# EAGLE design untitled (EAGLE 9.6.2)
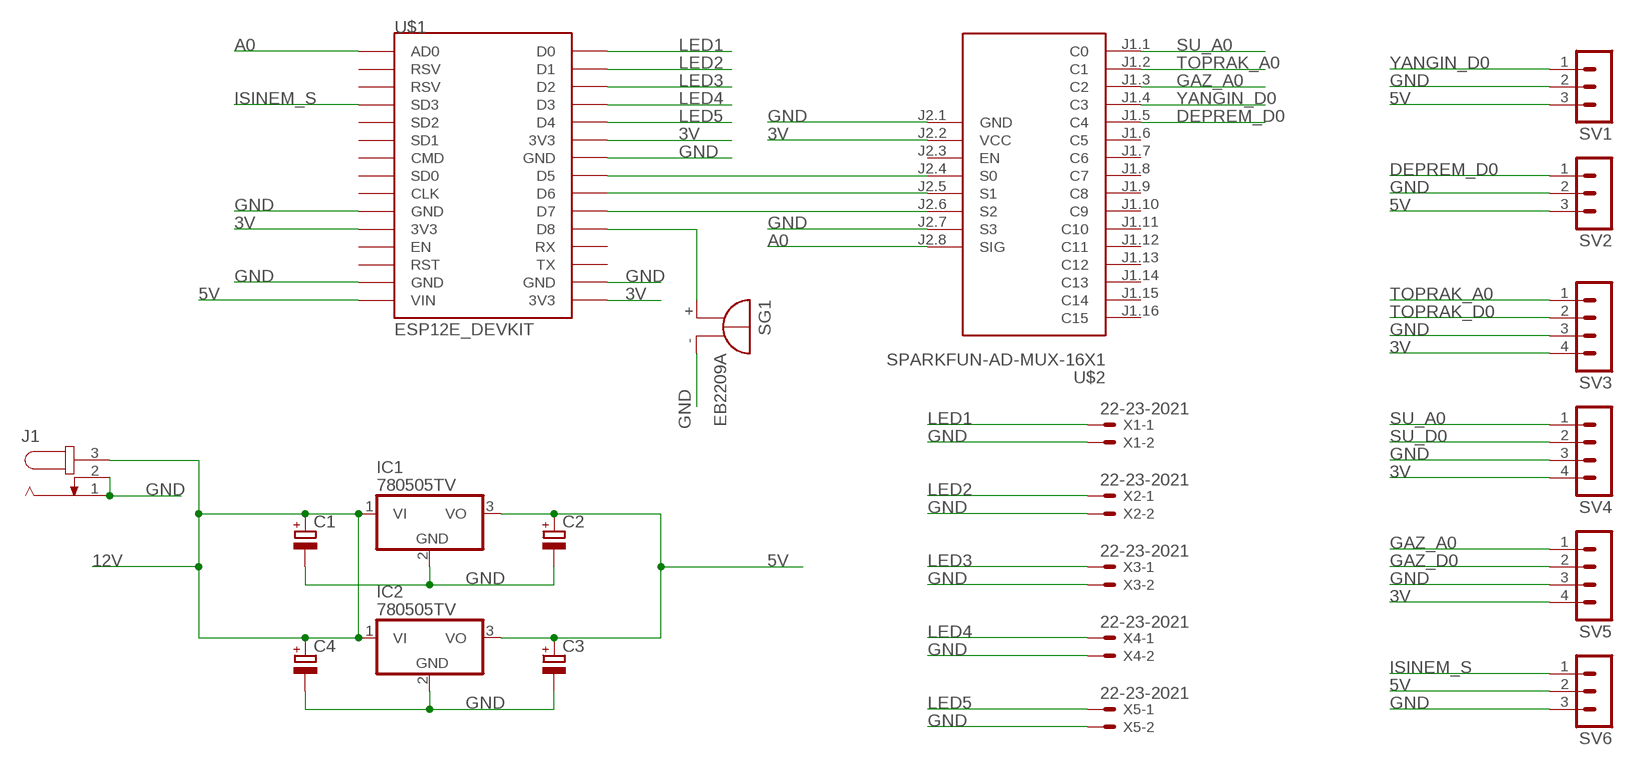
[diagram p0: schematic, sheet 1]

## Parts
C1  CPOL-EUE5-5  [E5-5]
C2  CPOL-EUE5-5  [E5-5]
C3  CPOL-EUE5-5  [E5-5]
C4  CPOL-EUE5-5  [E5-5]
IC1  780505TV  [TO220V]
IC2  780505TV  [TO220V]
J1  JACK-PLUG1  [SPC4078]
SG1  EB2209A  [EB2209A]
SV1  MA03-1  [MA03-1]
SV2  MA03-1  [MA03-1]
SV3  MA04-1  [MA04-1]
SV4  MA04-1  [MA04-1]
SV5  MA04-1  [MA04-1]
SV6  MA03-1  [MA03-1]
U$1  ESP12E_DEVKIT  [ESP12E_DEVKIT]
U$2  SPARKFUN-AD-MUX-16X1  [SPARKFUN-AD-MUX-16X1]
X1  22-23-2021  [22-23-2021]
X2  22-23-2021  [22-23-2021]
X3  22-23-2021  [22-23-2021]
X4  22-23-2021  [22-23-2021]
X5  22-23-2021  [22-23-2021]

## Nets
3V: SV3.4 SV4.4 SV5.4 U$1.3V3@0(3V3) U$1.3V3@1(3V3) U$1.3V3@2(3V3) U$2.J2.2(VCC)
5V: C2.+ C3.+ IC1.3(VO) IC2.3(VO) SV1.3 SV2.3 SV6.2 U$1.VIN
12V: C1.+ C4.+ IC1.1(VI) IC2.1(VI) J1.3
A0: U$1.AD0 U$2.J2.8(SIG)
DEPREM_D0: SV2.1 U$2.J1.5(C4)
GAZ_A0: SV5.1 U$2.J1.3(C2)
GAZ_D0: SV5.2
GND: C1.- C2.- C3.- C4.- IC1.2(GND) IC2.2(GND) J1.1 J1.2 SG1.- SV1.2 SV2.2 SV3.3 SV4.3 SV5.3 SV6.3 U$1.GND@0(GND) U$1.GND@1(GND) U$1.GND@2(GND) U$1.GND@3(GND) U$2.J2.1(GND) U$2.J2.7(S3) X1.2 X2.2 X3.2 X4.2 X5.2
ISINEM_S: SV6.1 U$1.SD3
LED1: U$1.D0 X1.1
LED2: U$1.D1 X2.1
LED3: U$1.D2 X3.1
LED4: U$1.D3 X4.1
LED5: U$1.D4 X5.1
N$1: U$1.D5 U$2.J2.4(S0)
N$2: U$1.D6 U$2.J2.5(S1)
N$3: U$1.D7 U$2.J2.6(S2)
N$4: SG1.+ U$1.D8
SU_A0: SV4.1 U$2.J1.1(C0)
SU_D0: SV4.2
TOPRAK_A0: SV3.1 U$2.J1.2(C1)
TOPRAK_D0: SV3.2
YANGIN_D0: SV1.1 U$2.J1.4(C3)
Unconnected: U$1.CLK U$1.CMD U$1.EN U$1.RST U$1.RSV@0(RSV) U$1.RSV@1(RSV) U$1.RX U$1.SD0 U$1.SD1 U$1.SD2 U$1.TX U$2.J1.6(C5) U$2.J1.7(C6) U$2.J1.8(C7) U$2.J1.9(C8) U$2.J1.10(C9) U$2.J1.11(C10) U$2.J1.12(C11) U$2.J1.13(C12) U$2.J1.14(C13) U$2.J1.15(C14) U$2.J1.16(C15) U$2.J2.3(EN)

## Library data of the parts
C1-C4 = rcl:CPOL-EU: POLARIZED CAPACITOR, European symbol; SPICEPREFIX: C
IC1 IC2 = Eagle Mixed Library:7805: Positive VOLTAGE REGULATOR Source: http://cache.national.com/ds/LM/LM78L05.pdf http://www.fairchildsemi.com/ds/LM/LM7805.pdf
J1 = con-jack:JACK-PLUG: DC POWER JACK Power Jack, DC, Right Angle, Through Hole, Rated 5A at 16VDC, PC Terminals Distributor: Farnell (www.Farnell.de) Drawing: 84N1161.pdf / 84N1162.pdf Manufacturer: SPC Technology (www.spctechnology.com) Type: SPC4077 / SPC 4078; OC_FARNELL: unknown; OC_NEWARK: unknown
SG1 = buzzer:EB2209A: BUZZER Source: Buerklin; OC_FARNELL: unknown; OC_NEWARK: unknown
SV1 SV2 SV6 = con-lstb:MA03-1: PIN HEADER; OC_FARNELL: unknown; OC_NEWARK: unknown
SV3-SV5 = con-lstb:MA04-1: PIN HEADER; OC_FARNELL: unknown; OC_NEWARK: unknown
U$1 = ESP12E_DEVKIT:ESP12E_DEVKIT: ESP12E DEVKIT BOARD
U$2 = diy-modules:SPARKFUN-AD-MUX-16X1: SparkFun Analog/Digital MUX Breakout based on CD74HC4067 chip Source: https://www.sparkfun.com/products/9056
X1-X5 = con-molex:22-23-2021: .100" (2.54mm) Center Header - 2 Pin; MF: MOLEX; MPN: 22-23-2021; OC_FARNELL: 1462926; OC_NEWARK: 25C3832

## Board
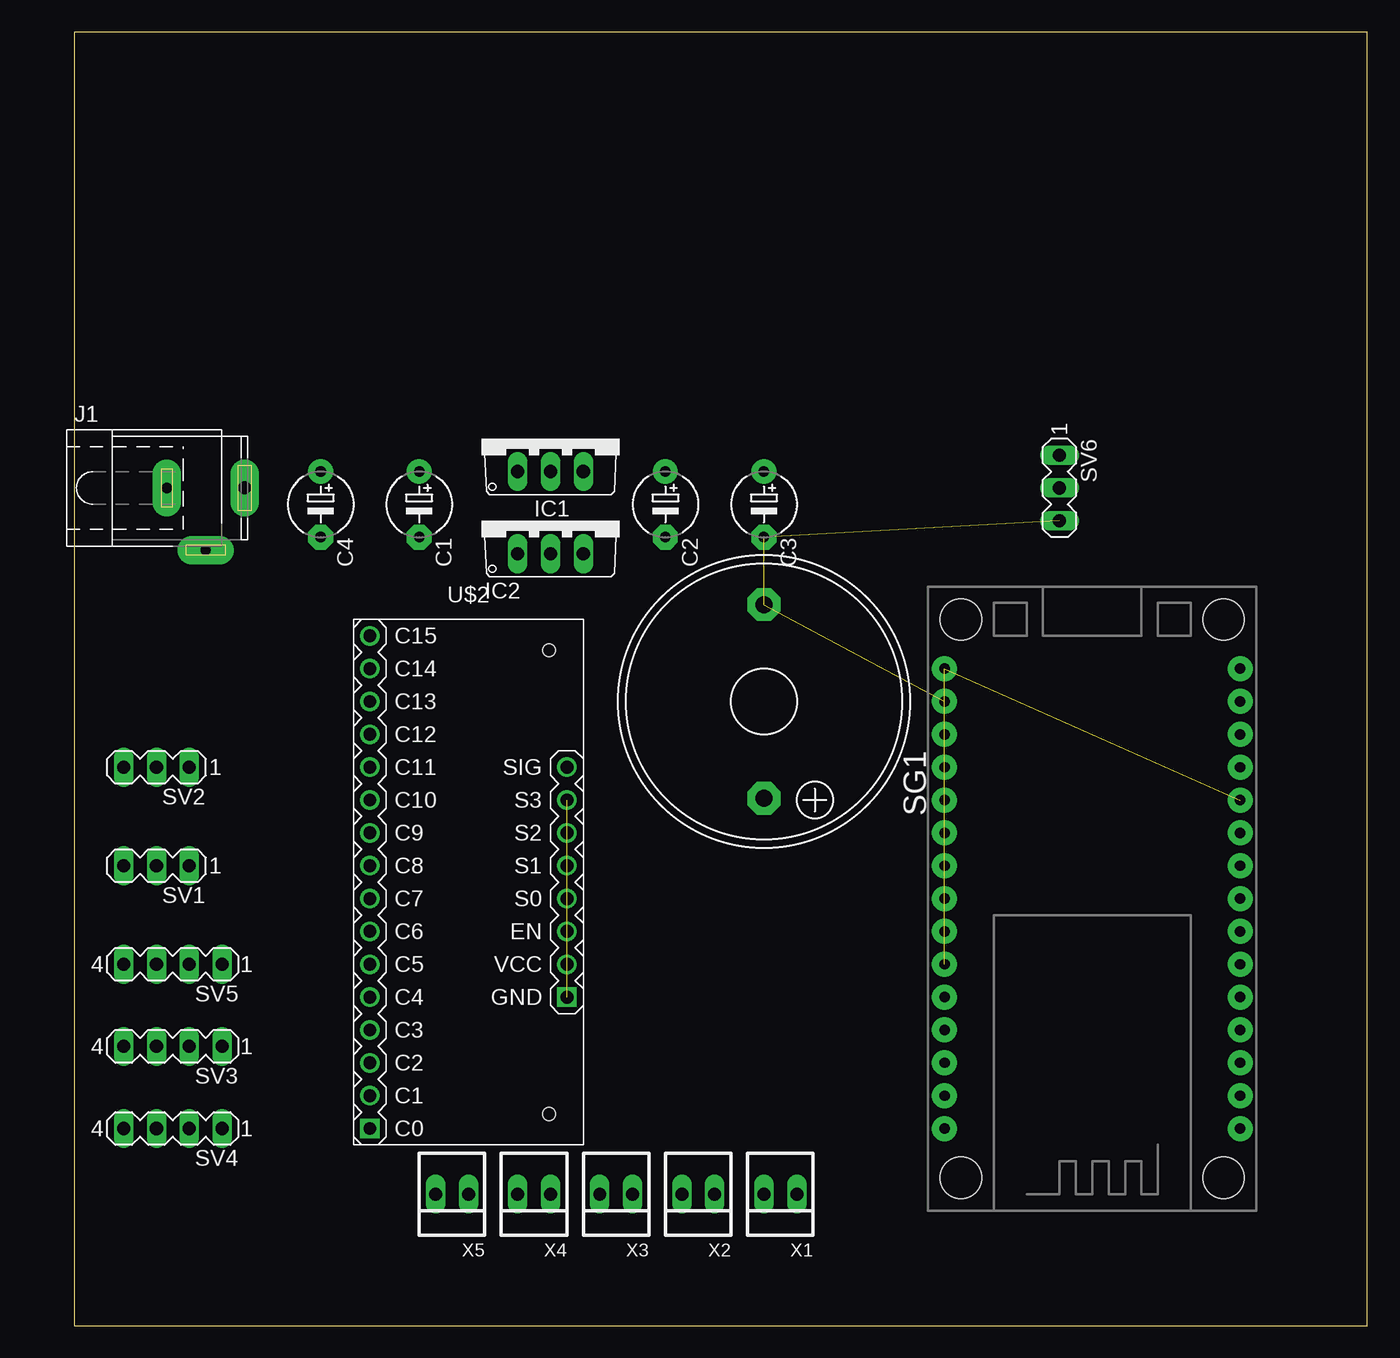
[diagram p1: board, top side]
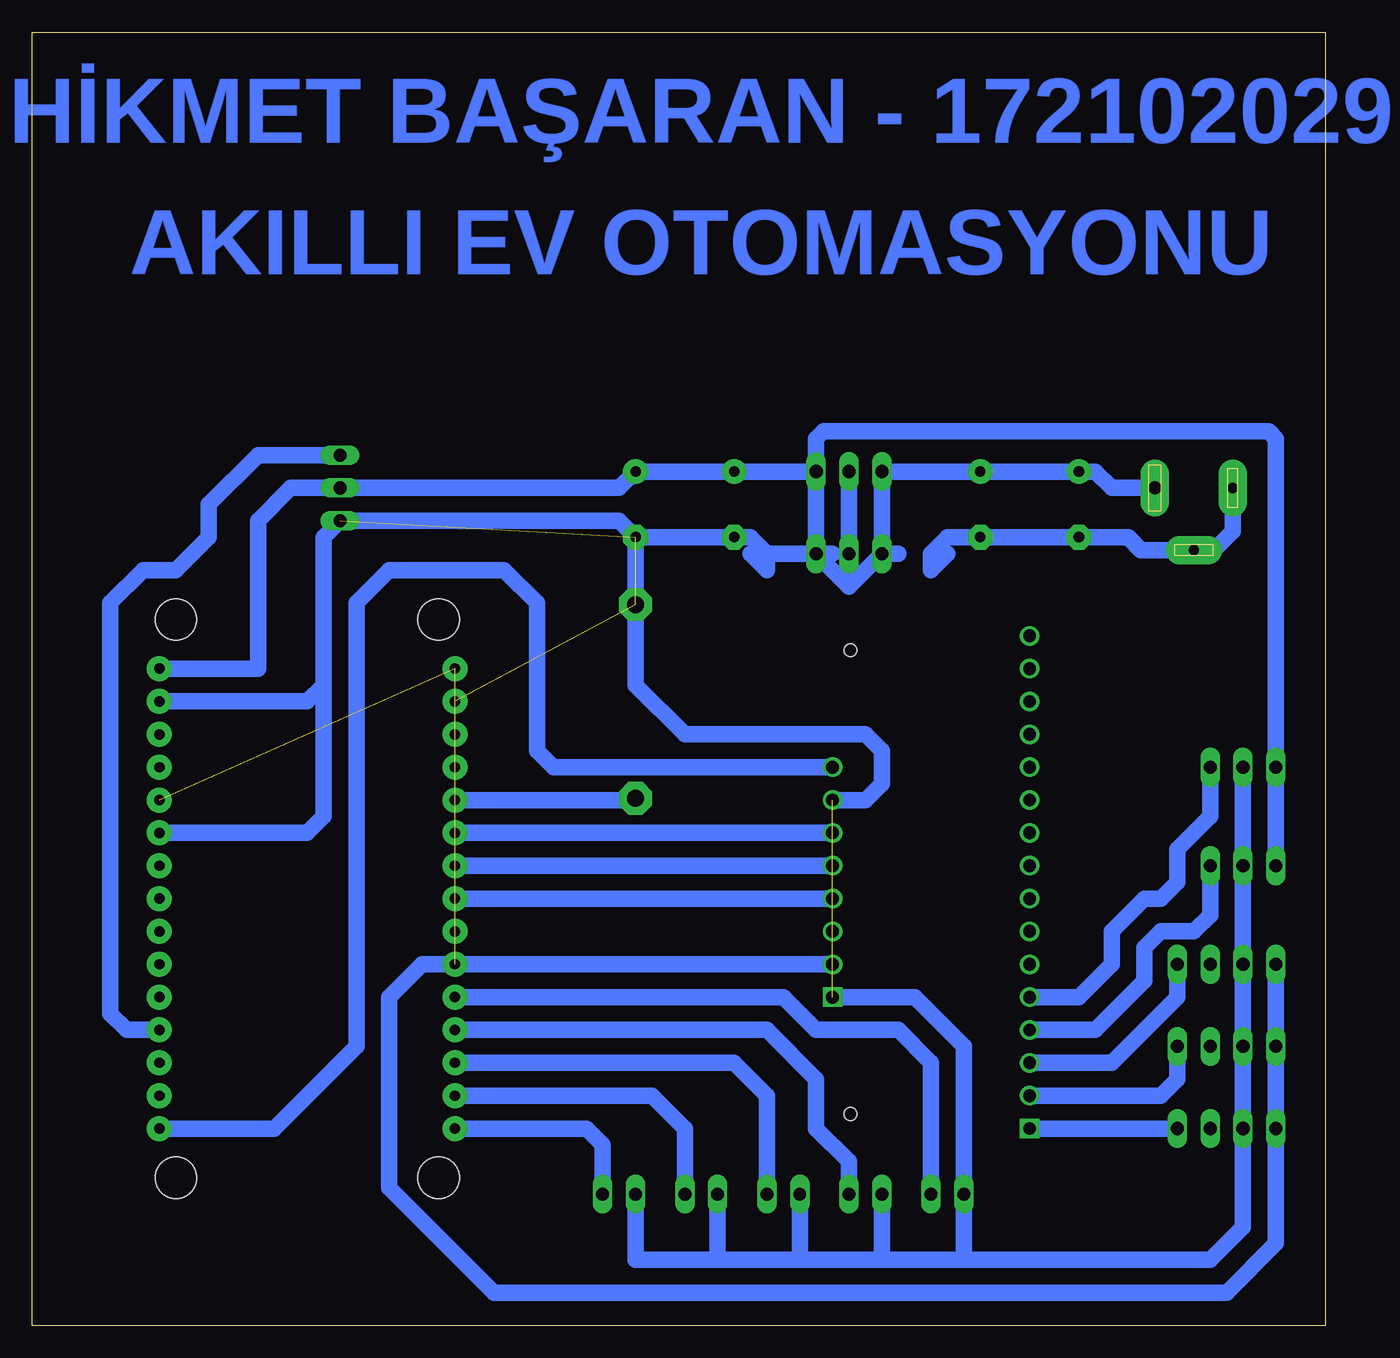
[diagram p2: board, bottom side, seen from below]

Size 100 x 100 mm. Coordinates in mm from the lower left corner, seen from the top.
Outline: 0,0 100,0 100,100 0,100 0,0
Copper layers (1*16): Top 0.035mm / dielectric 1.5mm / Bottom 0.035mm
Design rules "default": minimum track width 6mil, minimum drill 0.35mm, track to track 6mil, track to pad 6mil, pad to pad 6mil, via to via 6mil, smd to smd 6mil, copper to edge 40mil, drill to drill 6mil, minimum pad ring 10mil, minimum via ring 8mil, stop-mask expansion 4mil, vias tented up to drill 0mil, thermal gap 10mil

### Footprints (pad centres in the part's own frame; a part is rotated, then mirrored left to right if it is on the bottom)
E5-5 = drill 0.813 pad 1.905: + -2.54,0 | drill 0.813 pad 1.905 octagon: - 2.54,0
TO220V = drill 1.016 long: 1 -2.54,-2.54; 2 0,-2.54; 3 2.54,-2.54
SPC4078 = drill 0.8 pad 2.184 long: 1 -3,0; 2 0,-4.8 | drill 1 pad 2.184 long: 3 3,0
EB2209A = drill 1.321 pad 2.54 octagon: + 7.493,0; - -7.493,0
MA03-1 = drill 1.016 long: 1 -2.54,0; 2 0,0; 3 2.54,0
MA04-1 = drill 1.016 long: 1 -3.81,0; 2 -1.27,0; 3 1.27,0; 4 3.81,0
ESP12E_DEVKIT = drill 0.8 pad 1.93: 3V3@0 -11.43,-7.62; 3V3@1 11.43,5.08; 3V3@2 11.43,-17.78; AD0 -11.43,17.78; CLK -11.43,-2.54; CMD -11.43,2.54; D0 11.43,17.78; D1 11.43,15.24; D2 11.43,12.7; D3 11.43,10.16; D4 11.43,7.62; D5 11.43,0; D6 11.43,-2.54; D7 11.43,-5.08; D8 11.43,-7.62; EN -11.43,-10.16; GND@0 -11.43,-5.08; GND@1 -11.43,-15.24; GND@2 11.43,2.54; GND@3 11.43,-15.24; RST -11.43,-12.7; RSV@0 -11.43,15.24; RSV@1 -11.43,12.7; RX 11.43,-10.16; SD0 -11.43,0; SD1 -11.43,5.08; SD2 -11.43,7.62; SD3 -11.43,10.16; TX 11.43,-12.7; VIN -11.43,-17.78 | hole 3.2: -10.16,21.59; 10.16,21.59; 10.16,-21.59; -10.16,-21.59
SPARKFUN-AD-MUX-16X1 = drill 1 square: J1.1 -7.62,-19.05; J2.1 7.62,-8.89 | drill 1: J1.2 -7.62,-16.51; J1.3 -7.62,-13.97; J1.4 -7.62,-11.43; J1.5 -7.62,-8.89; J1.6 -7.62,-6.35; J1.7 -7.62,-3.81; J1.8 -7.62,-1.27; J1.9 -7.62,1.27; J1.10 -7.62,3.81; J1.11 -7.62,6.35; J1.12 -7.62,8.89; J1.13 -7.62,11.43; J1.14 -7.62,13.97; J1.15 -7.62,16.51; J1.16 -7.62,19.05; J2.2 7.62,-6.35; J2.3 7.62,-3.81; J2.4 7.62,-1.27; J2.5 7.62,1.27; J2.6 7.62,3.81; J2.7 7.62,6.35; J2.8 7.62,8.89 | hole 1: 6.245,-17.93; 6.245,17.93
22-23-2021 = drill 1 long: 1 -1.27,0; 2 1.27,0

### Placement (x,y rotation side)
C1  26.67,63.5 270 top
C2  45.72,63.5 270 top
C3  53.34,63.5 270 top
C4  19.05,63.5 270 top
IC1  36.83,68.58 0 top
IC2  36.83,62.23 0 top
J1  10.16,64.77 0 top
SG1  53.34,48.26 270 top
SV1  6.35,35.56 180 top
SV2  6.35,43.18 180 top
SV3  7.62,21.59 180 top
SV4  7.62,15.24 180 top
SV5  7.62,27.94 180 top
SV6  76.2,64.77 270 top
U$1  78.74,33.02 180 top
U$2  30.48,34.29 0 top
X1  54.61,10.16 180 top
X2  48.26,10.16 180 top
X3  41.91,10.16 180 top
X4  35.56,10.16 180 top
X5  29.21,10.16 180 top

### Tracks (layer width: path | path; a pad name or v marks a point on that pad's centre or on a via)
3V  (2 unrouted)
  Bottom 1.27: SV5.4 SV3.4 SV4.4 3.81,6.35 7.62,2.54 64.29,2.54 72.39,10.64 72.39,25.4 69.85,27.94 U$1.3V3@1 U$2.J2.2
5V
  Bottom 1.27: IC2.3 IC1.3 | IC1.3 C2.+ C3.+ 54.61,64.77 SV6.2 80.01,64.77 82.55,62.23 82.55,50.8 U$1.VIN | SV1.3 SV2.3 3.81,68.58 4.37,69.14 38.81,69.14 39.37,68.58 IC1.3
12V
  Bottom 1.27: J1.3 16.51,64.77 17.78,66.04 C4.+ C1.+ IC1.1 IC2.1
A0
  Bottom 1.27: U$1.AD0 81.28,15.24 74.93,21.59 74.93,55.88 72.39,58.42 63.5,58.42 60.96,55.88 60.96,44.45 59.69,43.18 U$2.J2.8
DEPREM_D0
  Bottom 1.27: U$2.J1.5 19.05,25.4 16.51,27.94 16.51,30.48 13.97,33.02 12.7,33.02 11.43,34.29 11.43,36.83 8.89,39.37 SV2.1
GAZ_A0
  Bottom 1.27: SV5.1 11.43,25.4 16.51,20.32 U$2.J1.3
GND  (6 unrouted)
  Bottom 1.27: J1.1 7.16,61.42 8.61,59.97 J1.2 14.25,59.97 15.24,60.96 C4.- C1.- 29.21,60.96 30.48,59.69 30.48,58.42 29.21,59.69 | IC1.2 IC2.2 36.83,57.15 | 36.83,57.15 34.29,59.69 33.02,59.69 | 36.83,57.15 39.37,59.69 | 38.1,59.69 44.45,59.69 43.18,58.42 43.18,59.69 44.45,60.96 C2.- C3.- | SV2.2 SV1.2 SV5.3 SV3.3 SV4.3 6.35,7.62 8.89,5.08 27.94,5.08 | 46.99,5.08 53.34,5.08 X1.2 | 46.99,5.08 40.64,5.08 | 40.64,5.08 34.29,5.08 | 34.29,5.08 27.94,5.08 | 27.94,5.08 X5.2 27.94,21.59 31.75,25.4 U$2.J2.1 | X4.2 34.29,5.08 | X3.2 40.64,5.08 | X2.2 46.99,5.08 | U$2.J2.7 35.56,40.64 34.29,41.91 34.29,44.45 35.56,45.72 49.53,45.72 53.34,49.53 SG1.- C3.- | C3.- 54.61,62.23 SV6.3 77.47,60.96 77.47,49.53 | U$1.GND@1 78.74,48.26 77.47,49.53 | U$1.GND@0 78.74,38.1 77.47,39.37 77.47,49.53
ISINEM_S
  Bottom 1.27: SV6.1 82.55,67.31 86.36,63.5 86.36,60.96 88.9,58.42 91.44,58.42 93.98,55.88 93.98,24.13 92.71,22.86 U$1.SD3
LED1
  Bottom 1.27: X1.1 55.88,13.97 57.15,15.24 U$1.D0
LED2
  Bottom 1.27: U$1.D1 52.07,17.78 49.53,15.24 X2.1
LED3
  Bottom 1.27: X3.1 43.18,17.78 45.72,20.32 U$1.D2
LED4
  Bottom 1.27: U$1.D3 43.18,22.86 39.37,19.05 39.37,15.24 36.83,12.7 X4.1
LED5
  Bottom 1.27: X5.1 30.48,20.32 33.02,22.86 39.37,22.86 41.91,25.4 U$1.D4
N$1
  Bottom 1.27: U$1.D5 U$2.J2.4
N$2
  Bottom 1.27: U$1.D6 U$2.J2.5
N$3
  Bottom 1.27: U$1.D7 U$2.J2.6
N$4
  Bottom 1.27: U$1.D8 53.47,40.64 SG1.+
SU_A0
  Bottom 1.27: SV4.1 U$2.J1.1
TOPRAK_A0
  Bottom 1.27: U$2.J1.2 12.7,17.78 11.43,19.05 SV3.1
YANGIN_D0
  Bottom 1.27: SV1.1 8.89,31.75 10.16,30.48 12.7,30.48 13.97,29.21 13.97,26.67 17.78,22.86 U$2.J1.4

### Text on the board
Bottom: HİKMET BAŞARAN - 172102029 / AKILLI EV OTOMASYONU